# Altium schematic sheet 03 SIMCOM.SchDoc
size A3; SheetNumber: 4; SheetTotal: 5
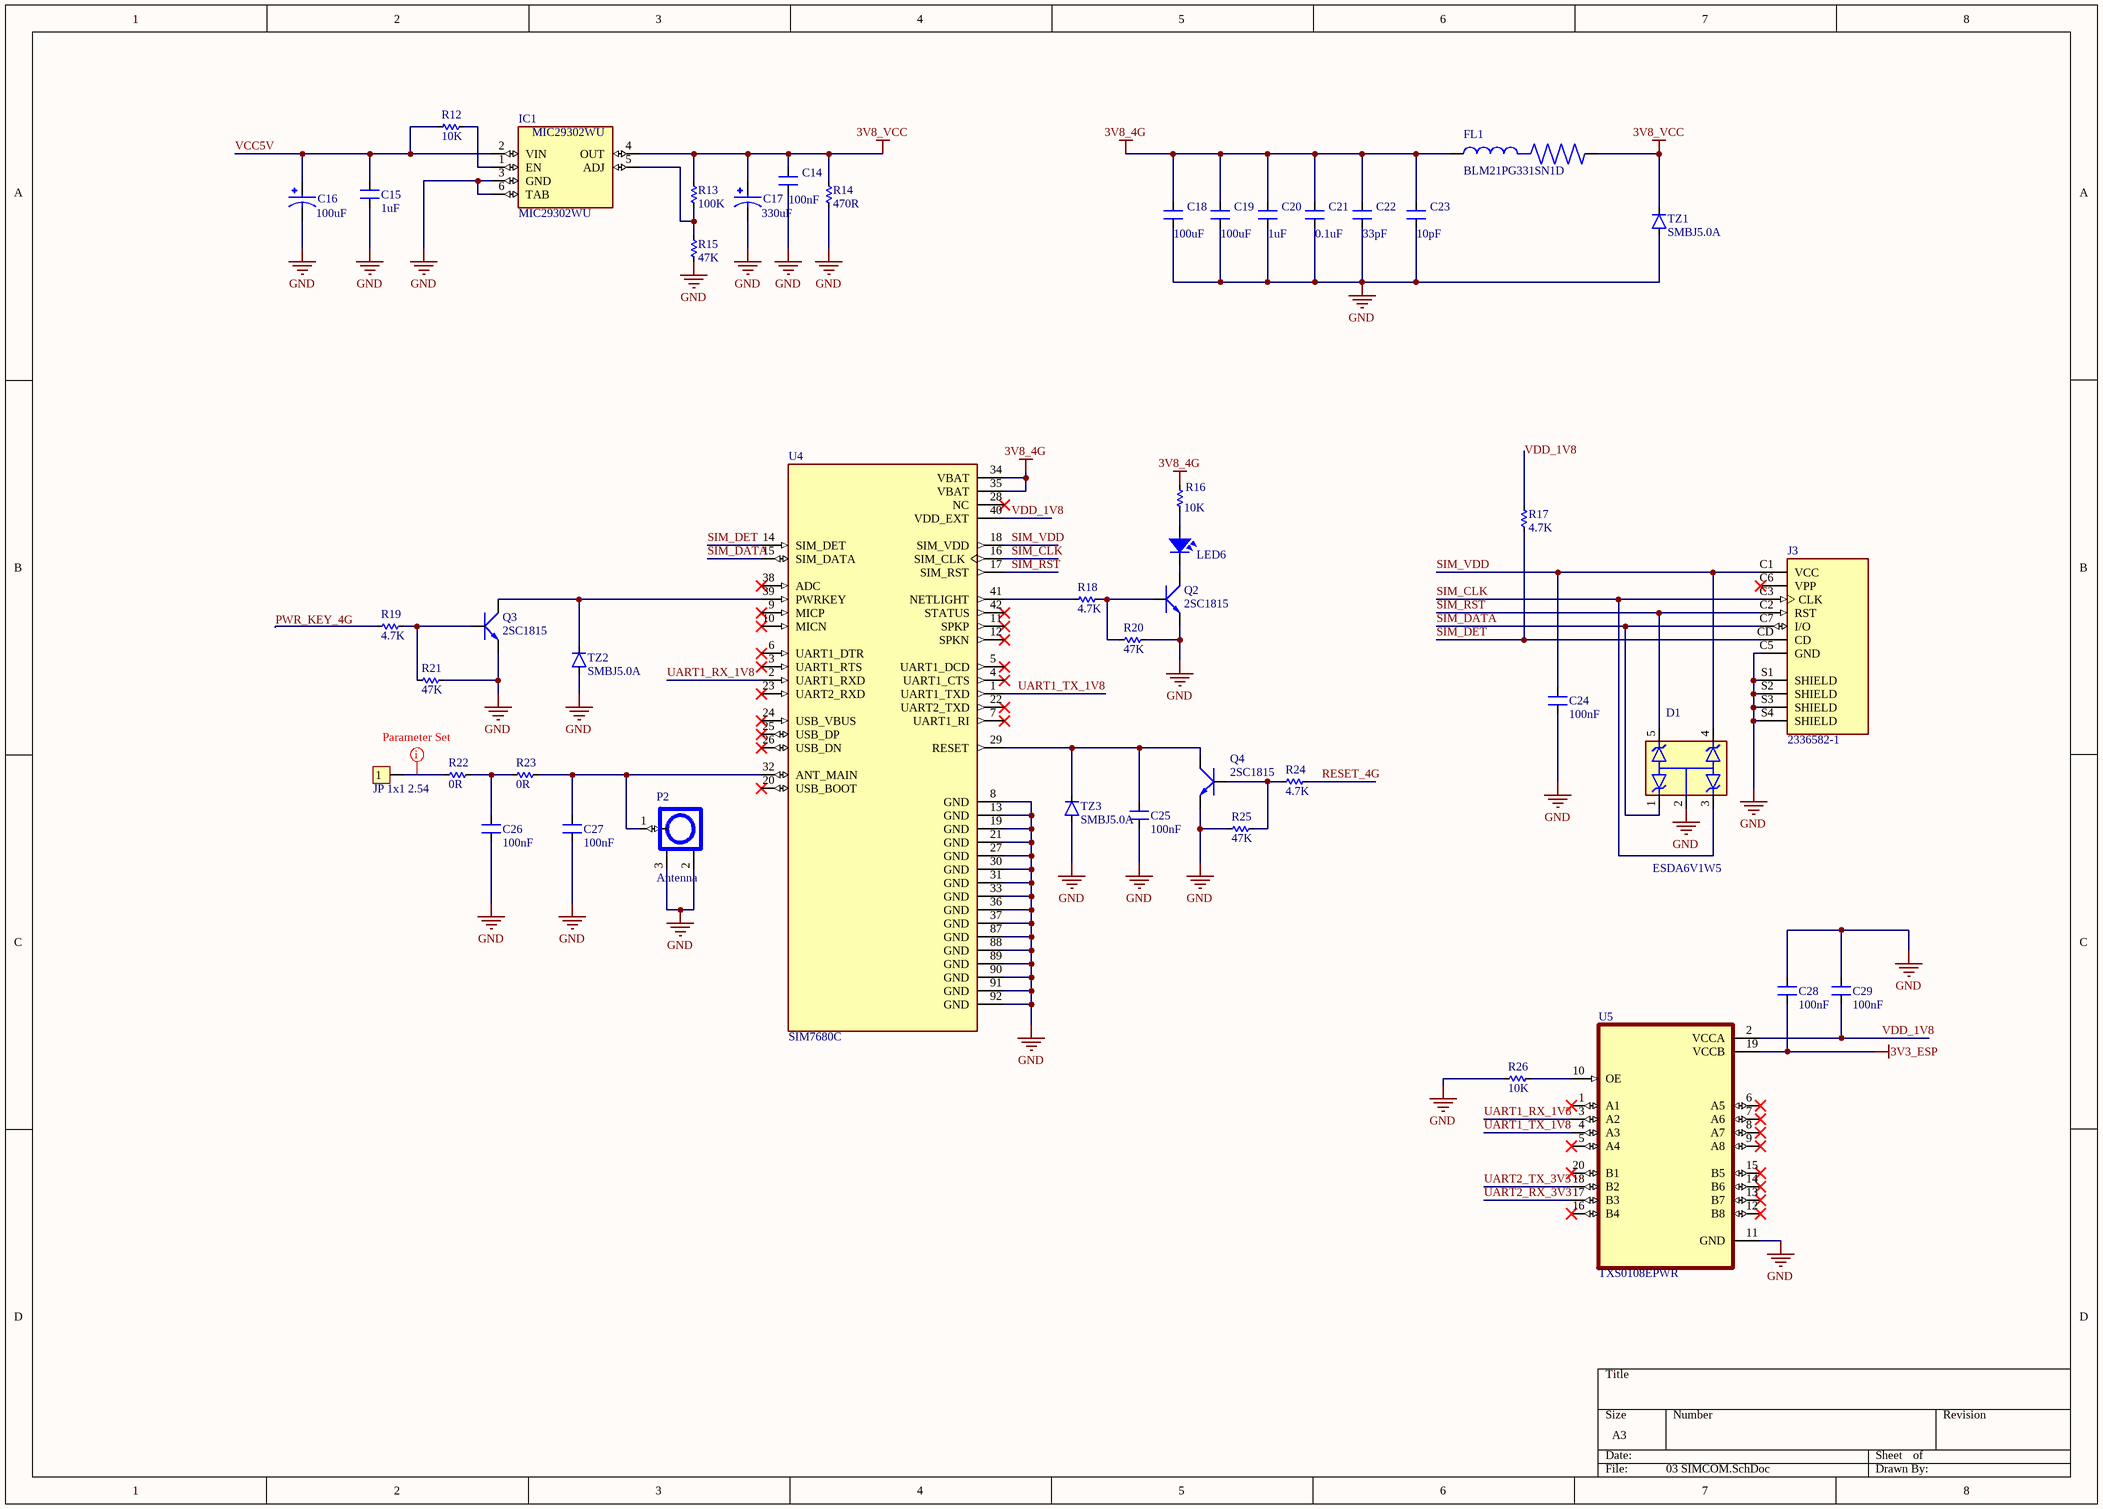
[diagram p0: 03 SIMCOM.SchDoc]

## Parts
C14  100nF  [C 0603]
C15  1uF  [C 0603]
C16  100uF  [CAP_TANTALUM_3528]
C17  330uF  [CAP_TANTALUM_3528]
C18  100uF  [C 0603]
C19  100uF  [C 0603]
C20  1uF  [C 0603]
C21  0.1uF  [C 0603]
C22  33pF  [C 0603]
C23  10pF  [C 0603]
C24  100nF  [C 0603]
C25  100nF  [C 0603]
C26  100nF  [C 0603]
C27  100nF  [C 0603]
C28  100nF  [C 0603]
C29  100nF  [C 0603]
D1  ESDA6V1W5  [SOT65P210X110-5N]
FL1  BLM21PG331SN1D  [BEADC2012X105N]
IC1  MIC29302WU  [MIC29302WU]
J3  2336582-1  [TE_2336582-1]
JP1  JP 1x1 2.54  [JP 1x1 DT]
LED6  LED  [LED-0603]  (value not drawn)
P2  Antenna  [IPXS]
Q2  2SC1815  [SOT23-321]
Q3  2SC1815  [SOT23-321]
Q4  2SC1815  [SOT23-321]
R12  10K  [RES-SMD-0603]
R13  100K  [RES-SMD-0603]
R14  470R  [RES-SMD-0603]
R15  47K  [RES-SMD-0603]
R16  10K  [RES-SMD-0603]
R17  4.7K  [RES-SMD-0603]
R18  4.7K  [RES-SMD-0603]
R19  4.7K  [RES-SMD-0603]
R20  47K  [RES-SMD-0603]
R21  47K  [RES-SMD-0603]
R22  0R  [RES-SMD-0603]
R23  0R  [RES-SMD-0603]
R24  4.7K  [RES-SMD-0603]
R25  47K  [RES-SMD-0603]
R26  10K  [RES-SMD-0603]
TZ1  SMBJ5.0A  [SMB]
TZ2  SMBJ5.0A  [SMB]
TZ3  SMBJ5.0A  [SMB]
U4  SIM7680C  [LCC110P1570X1760X250-42N]
U5  TXS0108EPWR  [SOP65P640X120-20N]

## Nets
3V3_ESP: C28.1 U5.19(VCCB)
3V8_4G: C18.1 C19.1 C20.1 C21.1 C22.1 C23.1 FL1.1 R16.2 U4.34(VBAT) U4.35(VBAT)
3V8_VCC: C14.1 C17.1 FL1.2 IC1.4(OUT) R13.1 R14.1 TZ1.2
GND: C14.2 C15.1 C16.2 C17.2 C18.2 C19.2 C20.2 C21.2 C22.2 C23.2 C24.1 C25.1 C26.1 C27.1 C28.2 C29.2 D1.2 IC1.3(GND) IC1.6(TAB) J3.C5(GND) J3.S1(SHIELD) J3.S2(SHIELD) J3.S3(SHIELD) J3.S4(SHIELD) P2.2 P2.3 Q2.1(E) Q3.1(E) Q4.1(E) R14.2 R15.2 R20.2 R21.1 R25.2 R26.2 TZ1.1 TZ2.1 TZ3.1 U4.8(GND) U4.13(GND) U4.19(GND) U4.21(GND) U4.27(GND) U4.30(GND) U4.31(GND) U4.33(GND) U4.36(GND) U4.37(GND) U4.87(GND) U4.88(GND) U4.89(GND) U4.90(GND) U4.91(GND) U4.92(GND) U5.11(GND)
PWR_KEY_4G: R19.1
RESET_4G: R24.2
SIM_CLK: D1.3 J3.C3(CLK) U4.16(SIM_CLK)
SIM_DATA: D1.1 J3.C7(I/O) U4.15(SIM_DATA)
SIM_DET: J3.CD R17.2 U4.14(SIM_DET)
SIM_RST: D1.5 J3.C2(RST) U4.17(SIM_RST)
SIM_VDD: C24.2 D1.4 J3.C1(VCC) U4.18(SIM_VDD)
UART1_RX_1V8: U4.2(UART1_RXD) U5.3(A2)
UART1_TX_1V8: U4.1(UART1_TXD) U5.4(A3)
UART2_RX_3V3: U5.17(B3)
UART2_TX_3V3: U5.18(B2)
VCC5V: C15.2 C16.1 IC1.2(VIN) R12.1
VDD_1V8: C29.1 R17.1 U4.40(VDD_EXT) U5.2(VCCA)
NetC25_2: C25.2 Q4.2(C) TZ3.2 U4.29(RESET)
NetC26_2: C26.2 R22.1 R23.2
NetC27_2: C27.2 P2.1 R23.1 U4.32(ANT_MAIN)
NetIC1_1: IC1.1(EN) R12.2
NetIC1_5: IC1.5(ADJ) R13.2 R15.1
NetJP1_1: JP1.1 R22.2
NetLED6_1: LED6.1 R16.1
NetLED6_2: LED6.2 Q2.2(C)
NetQ2_3: Q2.3(B) R18.2 R20.1
NetQ3_2: Q3.2(C) TZ2.2 U4.39(PWRKEY)
NetQ3_3: Q3.3(B) R19.2 R21.2
NetQ4_3: Q4.3(B) R24.1 R25.1
NetR18_1: R18.1 U4.41(NETLIGHT)
NetR26_1: R26.1 U5.10(OE)

Not connected (* = marked no-connect by the designer): J3 C6(VPP)*; U4 3(UART1_RTS)* 4(UART1_CTS)* 5(UART1_DCD)* 6(UART1_DTR)* 7(UART1_RI)* 9(MICP)* 10(MICN)* 11(SPKP)* 12(SPKN)* 20(USB_BOOT)* 22(UART2_TXD)* 23(UART2_RXD)* 24(USB_VBUS)* 25(USB_DP)* 26(USB_DN)* 28(NC)* 38(ADC)* 42(STATUS)*; U5 1(A1)* 5(A4)* 6(A5)* 7(A6)* 8(A7)* 9(A8)* 12(B8)* 13(B7)* 14(B6)* 15(B5)* 16(B4)* 20(B1)*

## Library data of the parts
C14 C18-C21 C23-C29 = CAP_SMD: Value: 33pF
C15 = CAP_SMD: 16V; Value: 33pF
C16 C17 = CAP_TANTALUM_SMD: Capacitor, Tantalum; MF: AVX; MP: TAJB475K025RNJ; SnapEDA_Link: https://www.snapeda.com/parts/TAJB475K025RNJ/AVX/view-part/?ref=snap; Package: 1411 AVX Corporation; Value: *; Check_prices: https://www.snapeda.com/parts/TAJB475K025RNJ/AVX/view-part/?ref=eda
C22 = CAP_SMD: Value: 33pF
D1 = ESDA6V1W5: - Clamp - Ipp Tvs Diode Surface Mount SOT-323-5; MF: STMicroelectronics; SnapEDA_Link: https://www.snapeda.com/parts/ESDA6V1W5/STMicroelectronics/view-part/?ref=snap; Availability: In Stock; Price: None; Value: *; Check_prices: https://www.snapeda.com/parts/ESDA6V1W5/STMicroelectronics/view-part/?ref=eda; Purchase-URL: https://pricing.snapeda.com/search/part/ESDA6V1W5/?ref=eda; MP: ESDA6V1W5; Package: SOT-323 STMicroelectronics
FL1 = BLM21PG331SN1D: SMD Ferrite 0805 330 Ohm +-25% 6000mA; Package: None; Price: None; Availability: Unavailable; MP: BLM21PG331SN1D; Value: *
IC1 = MIC29302WU: MF: {'manufacturer': u'Microchip Technology'}; Package: None; Price: None; Value: *; MP: MIC29302WU; Availability: Unavailable
J3 = 2336582-1: PUSH-PUSH NANO SIM CONNECTOR; Package: None; Price: None; Value: *; MP: 2336582-1; Availability: Unavailable
JP1 = JP 1x1 2.54 Duc Cong: Cắm; Ten_Linh_Kien: Jump Đơn Đực 2.54MM 1x40P Cong Đứng; Don_Vi: Con; Ma_Hang: MH000904; Ghi_Chu: *; Kieu_Chan: *; Chung_Loai: Cắm
LED6 = LED SMD: Value: LED 3 - 5 ly 2 Colour
P2 = IPXSx66: Antenna GSM GPS
Q2-Q4 = 2SC1815: NPN 600mW, ECB; Value: C1815
R12-R26 = Res-SMD: RES_SMD; Manufacturer: Generic Components; Class: Passive; Published: 08/06/2000; Publisher: Altium Hobart Technology Centre
TZ1-TZ3 = SMBJ5.0A: 9.2V Clamp 65.3A Ipp Tvs Diode Surface Mount DO-214AA _SMBJ_; MF: Littelfuse; MP: SMBJ5.0A; Availability: Unavailable; SnapEDA_Link: https://www.snapeda.com/parts/SMBJ5.0A/Littelfuse%20Inc/view-part/225678/?ref=snap; Package: DO-214 Bourns; Price: None; Value: *
U4 = SIM7680C: Module: GSM/Bluetooth; GPRS; 2G; 1800MHz, 900MHz; 85.6kbps; SMD; MP: SIM800C; MF: Simcom; Check_prices: https://www.snapeda.com/parts/SIM800C/SIMcom+Wireless+solutions+Co.%252CLtd/view-part/?ref=eda; Value: *; Availability: In Stock; Price: None; Package: None; SnapEDA_Link: https://www.snapeda.com/parts/SIM800C/SIMcom+Wireless+solutions+Co.%252CLtd/view-part/?ref=snap
U5 = TXS0108EPWR: 8-bit bidirectional voltage-level shifter for open-drain and push-pull application; MF: Texas Instruments; Value: *; SnapEDA_Link: https://www.snapeda.com/parts/TXS0108EPWR/Texas+Instruments/view-part/?ref=snap; Purchase-URL: https://pricing.snapeda.com/search/part/TXS0108EPWR/?ref=eda; Availability: In Stock; Price: None; Package: TSSOP-20 Texas Instruments; Check_prices: https://www.snapeda.com/parts/TXS0108EPWR/Texas+Instruments/view-part/?ref=eda; MP: TXS0108EPWR